# EAGLE schematic micromouse (EAGLE 9.0.1)
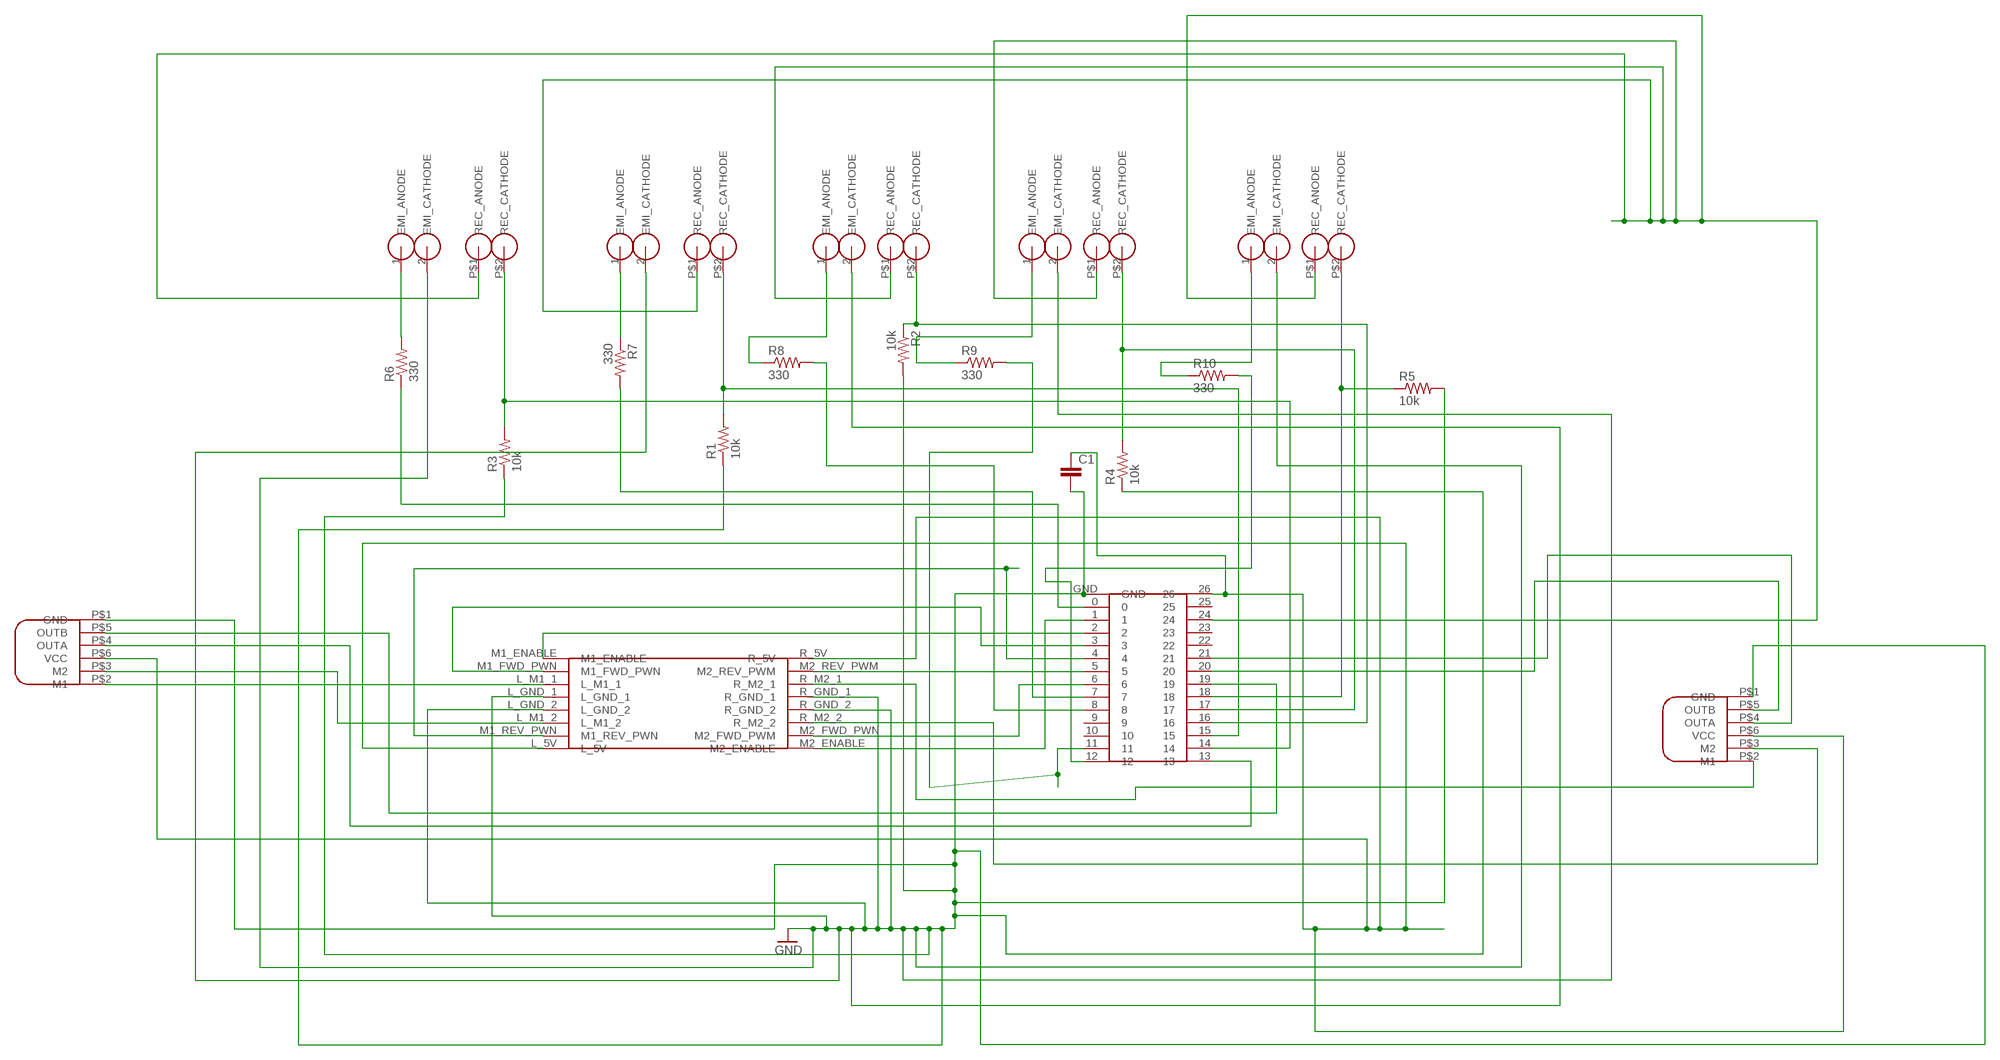
[diagram p0: schematic, sheet 1]

## Parts
C1  C2,5-3  [C2.5-3]
R1  10k  R-US_0204/5  [0204/5]
R2  10k  R-US_0204/5  [0204/5]
R3  10k  R-US_0204/5  [0204/5]
R4  10k  R-US_0204/5  [0204/5]
R5  10k  R-US_0204/5  [0204/5]
R6  330  R-US_0204/5  [0204/5]
R7  330  R-US_0204/5  [0204/5]
R8  330  R-US_0204/5  [0204/5]
R9  330  R-US_0204/5  [0204/5]
R10  330  R-US_0204/5  [0204/5]
U$1  TEENSY3.2  [TEENSY3.2]
U$2  MOTOR_DRIVER  [MOTOR_DRIVER]
U$3  IR_RECIEVER  [IR_RECIEVER]
U$4  IR_RECIEVER  [IR_RECIEVER]
U$5  IR_RECIEVER  [IR_RECIEVER]
U$6  IR_RECIEVER  [IR_RECIEVER]
U$7  IR_RECIEVER  [IR_RECIEVER]
U$8  IR_EMITTER  [IR_EMITTER]
U$9  IR_EMITTER  [IR_EMITTER]
U$10  IR_EMITTER  [IR_EMITTER]
U$11  IR_EMITTER  [IR_EMITTER]
U$12  IR_EMITTER  [IR_EMITTER]
U$13  MOTOR_ENCODER  [MOTOR_ENCODER]
U$14  MOTOR_ENCODER  [MOTOR_ENCODER]

## Nets
GND: C1.2 R1.1 R2.2 R3.1 R4.1 R5.2 U$1.GND U$2.L_GND_1 U$2.L_GND_2 U$2.R_GND_1 U$2.R_GND_2 U$8.2(EMI_CATHODE) U$9.2(EMI_CATHODE) U$10.2(EMI_CATHODE) U$11.2(EMI_CATHODE) U$12.2(EMI_CATHODE) U$13.P$1(GND) U$14.P$1(GND)
N$1: U$1.2 U$2.M1_ENABLE
N$2: U$1.3 U$2.M1_FWD_PWN
N$3: U$2.L_M1_2 U$13.P$3(M2)
N$4: U$1.1 U$2.M2_ENABLE
N$5: U$1.5 U$2.M2_REV_PWM
N$6: U$2.R_M2_2 U$14.P$3(M2)
N$7: U$1.6 U$2.M2_FWD_PWN(M2_FWD_PWM)
N$8: U$1.4 U$2.M1_REV_PWN
N$9: R6.2 U$8.1(EMI_ANODE)
N$10: R6.1 U$1.0
N$11: R7.1 U$9.1(EMI_ANODE)
N$12: R7.2 U$1.7
N$13: R8.1 U$10.1(EMI_ANODE)
N$14: R8.2 U$1.8
N$15: R9.1 U$11.1(EMI_ANODE)
N$16: R9.2 U$1.11
N$17: R10.1 U$12.1(EMI_ANODE)
N$18: R10.2 U$1.12
N$19: R1.2 U$1.15 U$4.P$2(REC_CATHODE)
N$20: R2.1 U$1.16 U$5.P$2(REC_CATHODE)
N$21: R4.2 U$1.17 U$6.P$2(REC_CATHODE)
N$22: R5.1 U$1.18 U$7.P$2(REC_CATHODE)
N$24: R3.2 U$1.14 U$3.P$2(REC_CATHODE)
N$25: U$2.L_M1_1 U$13.P$2(M1)
N$26: U$1.20 U$14.P$5(OUTB)
N$27: U$1.13 U$13.P$4(OUTA)
N$28: U$1.21 U$14.P$4(OUTA)
N$29: U$1.19 U$13.P$5(OUTB)
N$30: C1.1 U$1.26 U$2.L_5V U$2.R_5V U$13.P$6(VCC) U$14.P$6(VCC)
N$32: U$2.R_M2_1 U$14.P$2(M1)
N$36: U$1.24 U$3.P$1(REC_ANODE) U$4.P$1(REC_ANODE) U$5.P$1(REC_ANODE) U$6.P$1(REC_ANODE) U$7.P$1(REC_ANODE)
Unconnected: U$1.9 U$1.10 U$1.22 U$1.23 U$1.25

## Library data of the parts
C1 = capacitor-wima:C: CAPACITOR naming: grid - package width
R1-R10 = rcl:R-US_: RESISTOR, American symbol; SPICEPREFIX: R
U$1 = teensy_3.2:TEENSY3.2
U$2 = motor_driver:MOTOR_DRIVER
U$3-U$7 = IR_RECIEVER:IR_RECIEVER
U$8-U$12 = IR_EMITTER:IR_EMITTER
U$13 U$14 = MOTOR_ENCODER:MOTOR_ENCODER